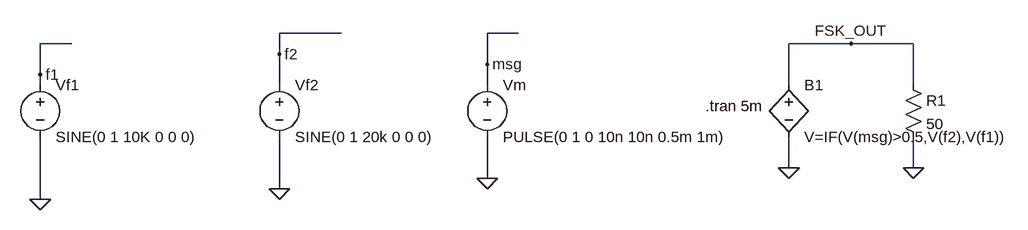
[diagram p0: schematic Q8 Frequency Shift Keying (FSK).asc]
Q8 Frequency Shift Keying (FSK).asc, the LTspice schematic file:
Version 4
SHEET 1 1624 680
WIRE 560 32 464 32
WIRE 832 32 784 32
WIRE 144 48 96 48
WIRE 1344 48 1248 48
WIRE 1440 48 1344 48
WIRE 464 64 464 32
WIRE 784 80 784 32
WIRE 96 96 96 48
WIRE 96 112 96 96
WIRE 464 112 464 64
WIRE 784 112 784 80
WIRE 1248 112 1248 48
WIRE 1440 112 1440 48
WIRE 1248 240 1248 192
WIRE 1440 240 1440 192
WIRE 784 256 784 192
WIRE 464 272 464 192
WIRE 96 288 96 192
FLAG 96 288 0
FLAG 96 96 f1
FLAG 464 272 0
FLAG 464 64 f2
FLAG 784 256 0
FLAG 784 80 msg
FLAG 1248 240 0
FLAG 1440 240 0
FLAG 1344 48 FSK_OUT
SYMBOL voltage 96 96 R0
WINDOW 123 0 0 Left 0
WINDOW 39 0 0 Left 0
SYMATTR InstName Vf1
SYMATTR Value SINE(0 1 10K 0 0 0)
SYMBOL voltage 464 96 R0
WINDOW 123 0 0 Left 0
WINDOW 39 0 0 Left 0
SYMATTR InstName Vf2
SYMATTR Value SINE(0 1 20k 0 0 0)
SYMBOL voltage 784 96 R0
WINDOW 123 0 0 Left 0
WINDOW 39 0 0 Left 0
SYMATTR InstName Vm
SYMATTR Value PULSE(0 1 0 10n 10n 0.5m 1m)
SYMBOL bv 1248 96 R0
SYMATTR InstName B1
SYMATTR Value V=IF(V(msg)>0.5,V(f2),V(f1))
SYMBOL res 1424 96 R0
SYMATTR InstName R1
SYMATTR Value 50
TEXT 1120 144 Left 2 !.tran 5m

The netlist it stands for:
* Q8 Frequency Shift Keying (FSK).asc
Vf1 f1 0 SINE(0 1 10K 0 0 0)
Vf2 f2 0 SINE(0 1 20k 0 0 0)
Vm msg 0 PULSE(0 1 0 10n 10n 0.5m 1m)
B1 FSK_OUT 0 V=IF(V(msg)>0.5,V(f2),V(f1))
R1 FSK_OUT 0 50
.tran 5m
.backanno
.end